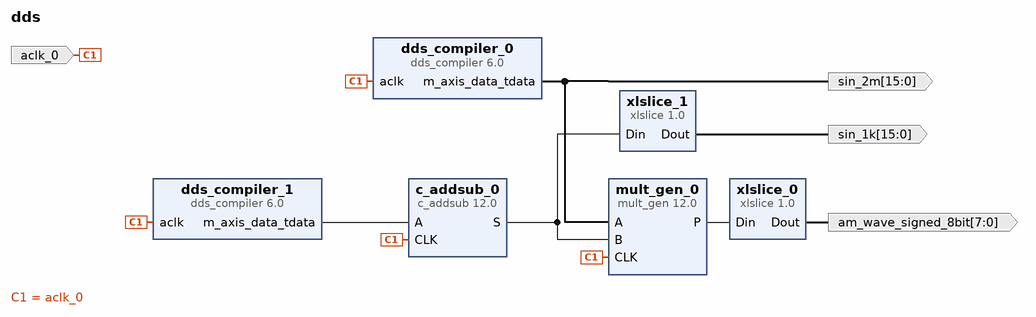
[diagram p0: block diagram of the top level]
# Vivado block design dds, xc7a35tfgg484-2, Vivado 2024.2
create_bd_design dds

create_bd_port -dir I -type clk aclk_0
create_bd_port -dir O -from 15 -to 0 sin_1k
create_bd_port -dir O -from 7 -to 0 am_wave_signed_8bit
create_bd_port -dir O -from 15 -to 0 sin_2m

create_bd_cell -type ip -vlnv xilinx.com:ip:dds_compiler:6.0 dds_compiler_0
set_property -dict [list \
  CONFIG.DATA_Has_TLAST Not_Required \
  CONFIG.DDS_Clock_Rate 50 \
  CONFIG.Frequency_Resolution 200 \
  CONFIG.Has_ACLKEN false \
  CONFIG.Has_ARESETn false \
  CONFIG.Has_Phase_Out false \
  CONFIG.Latency 8 \
  CONFIG.M_DATA_Has_TUSER Not_Required \
  CONFIG.Noise_Shaping Auto \
  CONFIG.OUTPUT_FORM Twos_Complement \
  CONFIG.Output_Frequency1 2 \
  CONFIG.Output_Selection Sine \
  CONFIG.Output_Width 16 \
  CONFIG.PINC1 10100011110101 \
  CONFIG.Phase_Increment Fixed \
  CONFIG.Phase_Width 18 \
  CONFIG.S_PHASE_Has_TUSER Not_Required \
  CONFIG.Spurious_Free_Dynamic_Range 96 \
] [get_bd_cells dds_compiler_0]
create_bd_cell -type ip -vlnv xilinx.com:ip:dds_compiler:6.0 dds_compiler_1
set_property -dict [list \
  CONFIG.DATA_Has_TLAST Not_Required \
  CONFIG.DDS_Clock_Rate 50 \
  CONFIG.Frequency_Resolution 1 \
  CONFIG.Has_ACLKEN false \
  CONFIG.Has_ARESETn false \
  CONFIG.Has_Phase_Out false \
  CONFIG.Latency 8 \
  CONFIG.M_DATA_Has_TUSER Not_Required \
  CONFIG.Noise_Shaping Auto \
  CONFIG.OUTPUT_FORM Twos_Complement \
  CONFIG.Output_Frequency1 0.001 \
  CONFIG.Output_Selection Sine \
  CONFIG.Output_Width 16 \
  CONFIG.PINC1 10100111110 \
  CONFIG.Phase_Increment Fixed \
  CONFIG.Phase_Width 26 \
  CONFIG.S_PHASE_Has_TUSER Not_Required \
  CONFIG.Spurious_Free_Dynamic_Range 96 \
] [get_bd_cells dds_compiler_1]
create_bd_cell -type ip -vlnv xilinx.com:ip:mult_gen:12.0 mult_gen_0
set_property -dict [list \
  CONFIG.Multiplier_Construction Use_Mults \
  CONFIG.OptGoal Speed \
  CONFIG.PortAWidth 16 \
  CONFIG.PortBWidth 17 \
] [get_bd_cells mult_gen_0]
create_bd_cell -type ip -vlnv xilinx.com:ip:xlslice:1.0 xlslice_0
set_property -dict {CONFIG.DIN_FROM 31 CONFIG.DIN_TO 24 CONFIG.DOUT_WIDTH 8} [get_bd_cells xlslice_0]
create_bd_cell -type ip -vlnv xilinx.com:ip:c_addsub:12.0 c_addsub_0
set_property -dict [list \
  CONFIG.A_Width 16 \
  CONFIG.B_Constant true \
  CONFIG.B_Type Unsigned \
  CONFIG.B_Value 1000000000000000 \
  CONFIG.B_Width 16 \
  CONFIG.CE false \
  CONFIG.C_In false \
  CONFIG.Implementation DSP48 \
  CONFIG.Latency 2 \
  CONFIG.Latency_Configuration Automatic \
  CONFIG.Out_Width 17 \
] [get_bd_cells c_addsub_0]
create_bd_cell -type ip -vlnv xilinx.com:ip:xlslice:1.0 xlslice_1
set_property -dict {CONFIG.DIN_FROM 15 CONFIG.DIN_TO 0 CONFIG.DIN_WIDTH 17 CONFIG.DOUT_WIDTH 16} [get_bd_cells xlslice_1]

# ---- connections ----

connect_bd_net -net aclk_0_1 [get_bd_ports aclk_0] \
  [get_bd_pins mult_gen_0/CLK] [get_bd_pins dds_compiler_0/aclk] [get_bd_pins dds_compiler_1/aclk] \
  [get_bd_pins c_addsub_0/CLK]
connect_bd_net [get_bd_pins c_addsub_0/S] [get_bd_pins xlslice_1/Din] [get_bd_pins mult_gen_0/B]
connect_bd_net [get_bd_pins dds_compiler_0/m_axis_data_tdata] [get_bd_pins mult_gen_0/A] [get_bd_ports sin_2m]
connect_bd_net [get_bd_pins dds_compiler_1/m_axis_data_tdata] [get_bd_pins c_addsub_0/A]
connect_bd_net [get_bd_pins mult_gen_0/P] [get_bd_pins xlslice_0/Din]
connect_bd_net [get_bd_pins xlslice_0/Dout] [get_bd_ports am_wave_signed_8bit]
connect_bd_net [get_bd_pins xlslice_1/Dout] [get_bd_ports sin_1k]

validate_bd_design
save_bd_design
